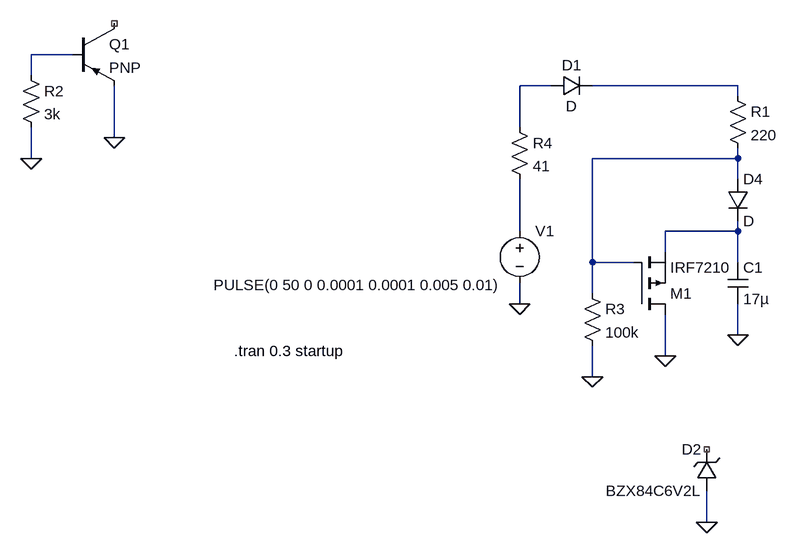
[diagram p0: schematic CapDischarge.asc]
CapDischarge.asc, the LTspice schematic file:
Version 4
SHEET 1 880 680
WIRE -640 -144 -704 -144
WIRE -704 -112 -704 -144
WIRE 96 -96 48 -96
WIRE 384 -96 160 -96
WIRE 384 -80 384 -96
WIRE 48 -32 48 -96
WIRE -576 -16 -576 -96
WIRE -704 16 -704 -32
WIRE 384 16 384 0
WIRE 384 16 160 16
WIRE 384 48 384 16
WIRE 48 128 48 48
WIRE 384 128 384 112
WIRE 384 128 272 128
WIRE 272 160 272 128
WIRE 160 176 160 16
WIRE 224 176 160 176
WIRE 384 176 384 128
WIRE 160 224 160 176
WIRE 48 240 48 208
WIRE 384 288 384 240
WIRE 272 320 272 256
WIRE 160 352 160 304
WIRE 336 576 336 528
FLAG 48 240 0
FLAG 384 288 0
FLAG -576 -16 0
FLAG -704 16 0
FLAG 272 320 0
FLAG 336 576 0
FLAG 160 352 0
SYMBOL voltage 48 112 R0
WINDOW 3 -471 99 Left 2
WINDOW 123 0 0 Left 0
WINDOW 39 0 0 Left 0
SYMATTR Value PULSE(0 50 0 0.0001 0.0001 0.005 0.01)
SYMATTR InstName V1
SYMBOL res 368 -96 R0
SYMATTR InstName R1
SYMATTR Value 220
SYMBOL cap 368 176 R0
SYMATTR InstName C1
SYMATTR Value 17µ
SYMBOL pnp -640 -192 R0
SYMATTR InstName Q1
SYMBOL res -720 -128 R0
SYMATTR InstName R2
SYMATTR Value 3k
SYMBOL pmos 224 256 M180
SYMATTR InstName M1
SYMATTR Value IRF7210
SYMBOL zener 352 528 R180
WINDOW 0 24 64 Left 2
WINDOW 3 24 0 Left 2
SYMATTR InstName D2
SYMATTR Value BZX84C6V2L
SYMBOL res 144 208 R0
SYMATTR InstName R3
SYMATTR Value 100k
SYMBOL diode 368 48 R0
SYMATTR InstName D4
SYMBOL diode 96 -80 R270
WINDOW 0 32 32 VTop 2
WINDOW 3 0 32 VBottom 2
SYMATTR InstName D1
SYMBOL res 32 -48 R0
SYMATTR InstName R4
SYMATTR Value 41
TEXT -392 312 Left 2 !.tran 0.3 startup

The netlist it stands for:
* CapDischarge.asc
V1 N005 0 PULSE(0 50 0 0.0001 0.0001 0.005 0.01)
R1 N003 N004 220
C1 N006 0 17µ
Q1 NC_01 N001 0 0 PNP
R2 N001 0 3k
M1 0 N004 N006 N006 IRF7210
D2 0 NC_02 BZX84C6V2L
R3 N004 0 100k
D4 N004 N006 D
D1 N002 N003 D
R4 N002 N005 41
.model D D
.lib standard.dio
.model NPN NPN
.model PNP PNP
.lib standard.bjt
.model NMOS NMOS
.model PMOS PMOS
.lib standard.mos
.tran 0.3 startup
.backanno
.end